# Altium schematic sheet Battery.SchDoc: Battery Connector
size A4; CheckedBy: Satya Mehta; Address3: Self Checkout Shopping Cart; DocumentNumber: 1; Revision: 1.0; SheetNumber: 2; SheetTotal: 7
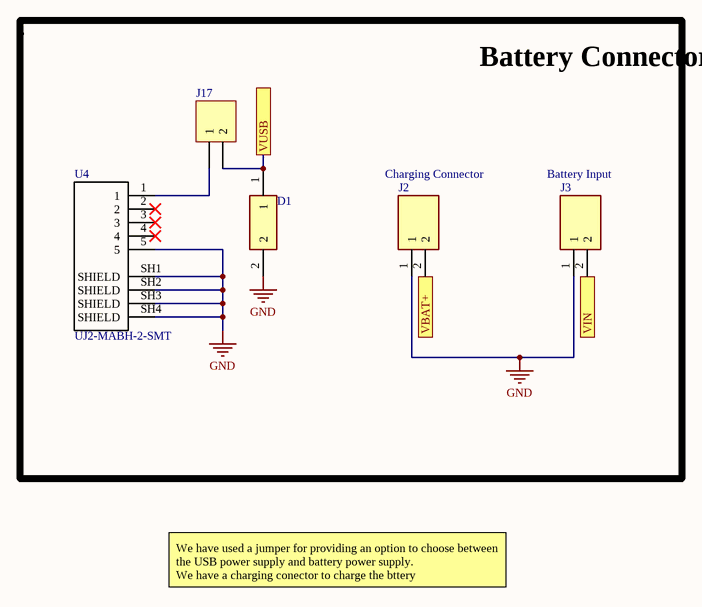
[diagram p0: Battery.SchDoc]

## Parts
D1  TPD1E10B06DPYT  [DPY(R-PX1SON-N2)]  (value not drawn)
J2  282837-2  [SHDR2W100P0X508_1X2_1016X820X1030P]  (value not drawn)
J3  282837-2  [SHDR2W100P0X508_1X2_1016X820X1030P]  (value not drawn)
J17  Header 2  [HDR1X2]  (value not drawn)
U4  UJ2-MABH-2-SMT  [*CUI_UJ2-MABH-2-SMT_UJ2-MABH-2-SMT(Primary)]

## Ports
VBAT+, VIN, VUSB

## Nets
GND: D1.2 J2.1 J3.1 U4.5 U4.SH1(SHIELD) U4.SH2(SHIELD) U4.SH3(SHIELD) U4.SH4(SHIELD)
VBAT+: J2.2 ; port VBAT+
VIN: J3.2 ; port VIN
VUSB: D1.1 J17.2 ; port VUSB
NetJ17_1: J17.1 U4.1

Not connected (* = marked no-connect by the designer): U4 2* 3* 4*

## Notes on the sheet
- Battery Connector
- Charging Connector
- Battery Input
- We have used a jumper for providing an option to choose between the USB power supply and battery power supply.
  We have a charging conector to charge the bttery
- Title
- Size:
- Date:
- A4
- Number:
- Time:
- Revision:
- Sheet
- of
- File:

## Library data of the parts
D1 = TPD1E10B06DPYT: TVS Diode (Bi-directional); Manufacturer_Name: Texas Instruments; Datasheet Link: http://www.ti.com/lit/ds/symlink/tpd1e10b06.pdf; Manufacturer_Part_Number: TPD1E10B06DPYT; Mouser Part Number: 595-TPD1E10B06DPYT; Mouser Price/Stock: https://www.mouser.com/Search/Refine.aspx?Keyword=595-TPD1E10B06DPYT
J2 J3 = 282837-2: Connector; Manufacturer_Name: TE Connectivity; Allied_Number: 70086281; Datasheet Link: http://www.te.com/commerce/DocumentDelivery/DDEController?Action=showdoc&DocId=Customer+Drawing%7F282837%7FG3%7Fpdf%7FEnglish%7FENG_CD_282837_G3.pdf%7F282837-2; Height: 10.3mm; Manufacturer_Part_Number: 282837-2; Mouser Part Number: 571-2828372; Mouser Price/Stock: https://www.mouser.com/Search/Refine.aspx?Keyword=571-2828372; RS Part Number: 7100100P; RS Price/Stock: http://uk.rs-online.com/web/p/products/7100100P; Allied Price/Stock: https://www.alliedelec.com/te-connectivity-282837-2/70086281/
J17 = Header 2: Header, 2-Pin; Manufacturer_Part_Number: BG301-04-A-0540-L-B; Manufacturer_Name: Global Connector Technology; Digi-Key Part Number: 2073-BG301-02-A-0540-L-BCT-ND; Value: *; Digikey Price/Stock: https://www.digikey.com/product-detail/en/gct/BG301-04-A-0540-L-B/2073-BG301-04-A-0540-L-BCT-ND/9859670?utm_source=snapeda&utm_medium=aggregator&utm_campaign=symbol
U4 = UJ2-MABH-2-SMT: Mini AB, USB 2.0, 1 A, Right Angle, Surface Mount _SMT_, USB Receptacle; Manufacturer_Part_Number: UJ2-MBH-3-SMT-TR; Manufacturer_Name: CUI Inc.; Price: None; Package: None; Digi-key Part Number: 102-5891-1-ND; Digikey Price/Stock: https://www.digikey.com/products/en?keywords=102-5891-1-ND; Value: *